# Altium schematic sheet mcu.SchDoc
size A4
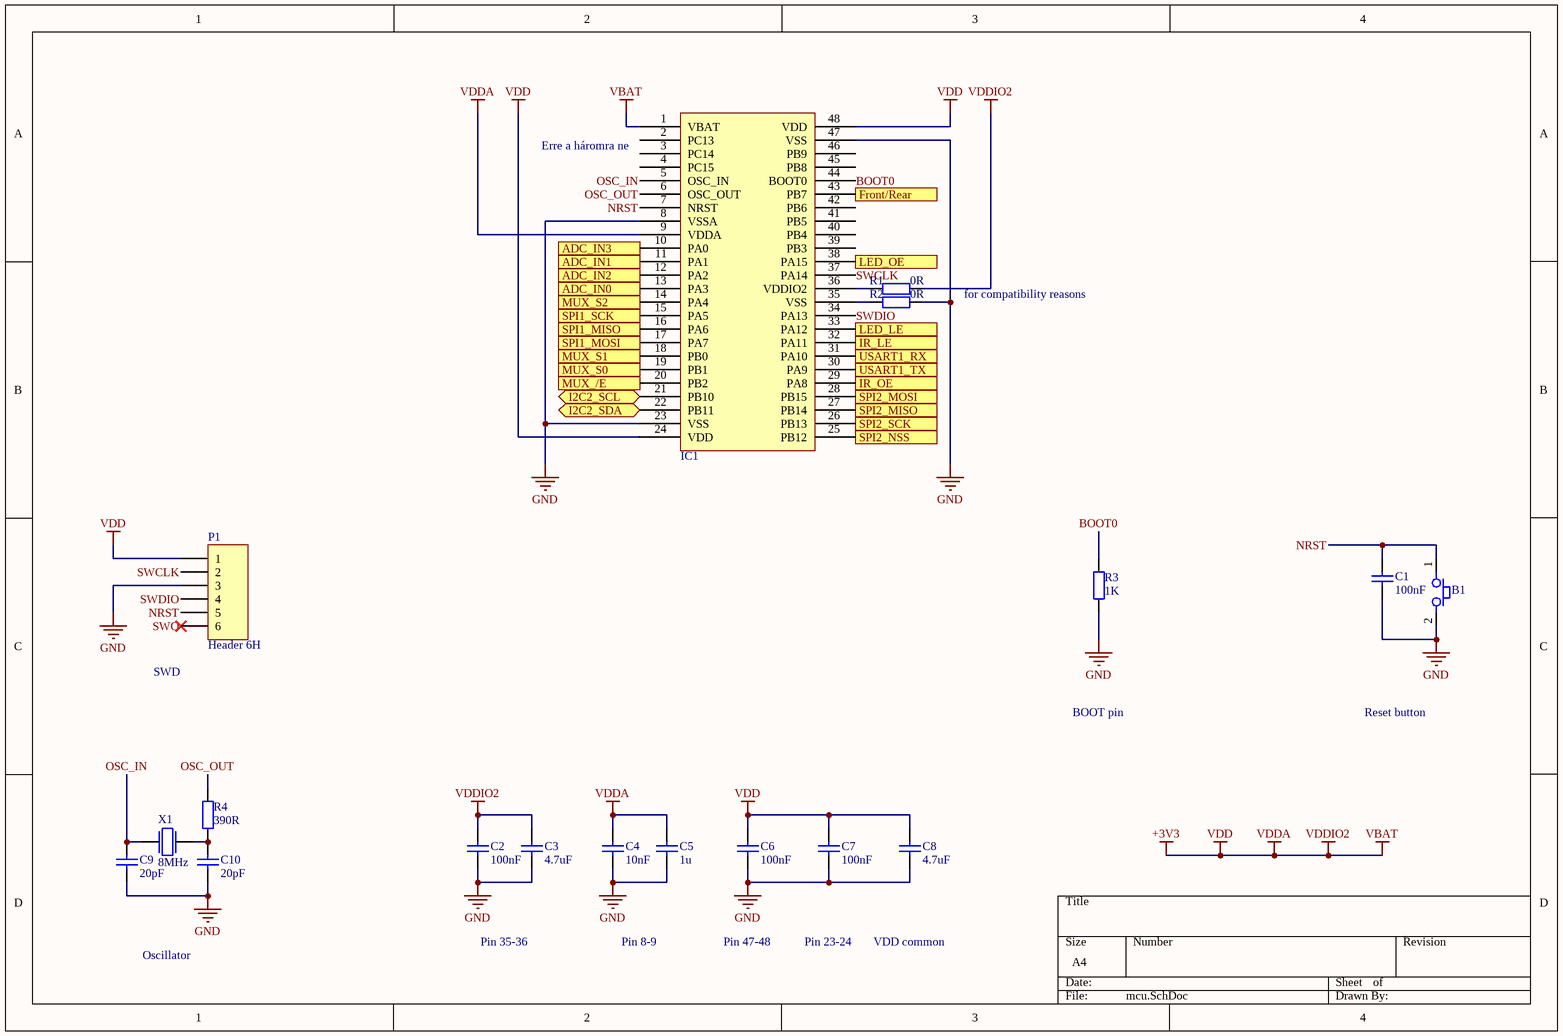
[diagram p0: mcu.SchDoc]

## Parts
B1  Button small  [FP_BTN_SMD_3x6]  (value not drawn)
C1  100nF  [FP_0805_CAP_085]
C2  100nF  [FP_0805_CAP_085]
C3  4.7uF  [FP_0805_CAP_085]
C4  10nF  [FP_0805_CAP_085]
C5  1u  [FP_0805_CAP_085]
C6  100nF  [FP_0805_CAP_085]
C7  100nF  [FP_0805_CAP_085]
C8  4.7uF  [FP_0805_CAP_085]
C9  20pF  [FP_0805_CAP_085]
C10  20pF  [FP_0805_CAP_085]
IC1  STM32F030C8T6  [LQFP48]  (value not drawn)
P1  Header 6H  [HDR1X6H]
R1  0R  [FP_0805_RES]
R2  0R  [FP_0805_RES]
R3  1K  [FP_0805_RES]
R4  390R  [FP_0805_RES]
X1  8MHz  [FP_CRYSTAL_HC49]

## Ports
ADC_IN0 (in), ADC_IN1 (in), ADC_IN2 (in), ADC_IN3 (in), Front/Rear (in), I2C2_SCL (bidir), I2C2_SDA (bidir), IR_LE (out), IR_OE (out), LED_LE (out), LED_OE (out), MUX_/E (out), MUX_S0 (out), MUX_S1 (out), MUX_S2 (out), SPI1_MISO (in), SPI1_MOSI (out), SPI1_SCK (out), SPI2_MISO (out), SPI2_MOSI (in), SPI2_NSS (in), SPI2_SCK (in), USART1_RX (in), USART1_TX (out)

## Nets
+3V3: C2.2 C3.2 C4.2 C5.2 C6.2 C7.2 C8.2 IC1.1(VBAT) IC1.9(VDDA) IC1.24(VDD) IC1.48(VDD) P1.1 R1.2  [also labelled VBAT, VDD, VDDA, VDDIO2]
GND: B1.2 C1.1 C2.1 C3.1 C4.1 C5.1 C6.1 C7.1 C8.1 C9.2 C10.2 IC1.8(VSSA) IC1.23(VSS) IC1.47(VSS) P1.3 R2.2 R3.1
ADC_IN0: IC1.13(PA3) ; port ADC_IN0
ADC_IN1: IC1.11(PA1) ; port ADC_IN1
ADC_IN2: IC1.12(PA2) ; port ADC_IN2
ADC_IN3: IC1.10(PA0) ; port ADC_IN3
BOOT0: IC1.44(BOOT0) R3.2
Front/Rear: IC1.43(PB7) ; port Front/Rear
I2C2_SCL: IC1.21(PB10) ; port I2C2_SCL
I2C2_SDA: IC1.22(PB11) ; port I2C2_SDA
IR_LE: IC1.32(PA11) ; port IR_LE
IR_OE: IC1.29(PA8) ; port IR_OE
LED_LE: IC1.33(PA12) ; port LED_LE
LED_OE: IC1.38(PA15) ; port LED_OE
MUX_/E: IC1.20(PB2) ; port MUX_/E
MUX_S0: IC1.19(PB1) ; port MUX_S0
MUX_S1: IC1.18(PB0) ; port MUX_S1
MUX_S2: IC1.14(PA4) ; port MUX_S2
NRST: B1.1 C1.2 IC1.7(NRST) P1.5
OSC_IN: C9.1 IC1.5(OSC_IN) X1.1
OSC_OUT: IC1.6(OSC_OUT) R4.2
SPI1_MISO: IC1.16(PA6) ; port SPI1_MISO
SPI1_MOSI: IC1.17(PA7) ; port SPI1_MOSI
SPI1_SCK: IC1.15(PA5) ; port SPI1_SCK
SPI2_MISO: IC1.27(PB14) ; port SPI2_MISO
SPI2_MOSI: IC1.28(PB15) ; port SPI2_MOSI
SPI2_NSS: IC1.25(PB12) ; port SPI2_NSS
SPI2_SCK: IC1.26(PB13) ; port SPI2_SCK
SWCLK: IC1.37(PA14) P1.2
SWDIO: IC1.34(PA13) P1.4
SWO: P1.6
USART1_RX: IC1.31(PA10) ; port USART1_RX
USART1_TX: IC1.30(PA9) ; port USART1_TX
NetC10_1: C10.1 R4.1 X1.2
NetIC1_35: IC1.35(VSS) R2.1
NetIC1_36: IC1.36(VDDIO2) R1.1

Not connected (* = marked no-connect by the designer): IC1 2(PC13) 3(PC14) 4(PC15) 39(PB3) 40(PB4) 41(PB5) 42(PB6) 45(PB8) 46(PB9)

## Notes on the sheet
- (near IC1) Erre a háromra ne
- for compatibility reasons
- (near P1) SWD
- BOOT pin
- Reset button
- Oscillator
- Pin 35-36
- Pin 8-9
- Pin 47-48
- Pin 23-24
- VDD common

## Library data of the parts
B1 = Button small: Push button; Name: TACT 3x 6 2P SPST 1 TS-363 (FEM) SMD 3.5x6mm H=4.3mm; Reference: 45-08-58; Supplier: Lomex
C1 C2 C6 C7 = CAP 100nF: Capacitor; Voltage: 50V; Reference: 2407344; Supplier: Farnell; Value: 100nF
C3 C8 = CAP 47uF: Capacitor; Reference: 2409055; Supplier: Farnell; Value: 4.7uF
C4 = CAP 10nF: Capacitor; Reference: 2896552; Supplier: Farnell; Value: 10nF
C5 = CAP: Capacitor; Reference: 2896565; Supplier: Farnell; Value: 1u
C9 C10 = CAP 100nF: Capacitor; Reference: 2581087; Value: 20pF; Supplier: Farnell
IC1 = STM32F030C8T6: STM32F030C8T6 ARM MCU; Reference: 2393634; Supplier: Farnell
P1 = Header 6H: Header, 6-Pin, Right Angle; Reference: ???; LatestRevisionDate: 17-Jul-2002; LatestRevisionNote: Re-released for DXP Platform.; Publisher: Altium Limited; Supplier: Árwill
R1 R2 = RES: Resistor; Reference: R_0; Value: 0R
R3 = RES 1K: Resistor; Reference: R_1K; Value: 1K
R4 = RES 390R: Resistor; Reference: 2072995; Supplier: Farnell; Value: 390R
X1 = Crystal: Quarz Crystal; Name: 8.000000MHz QUARZ HC49/S (NSK) 30ppm 20pF LOW PROFILE; Value: 8MHz; Reference: 40-01-16; Supplier: Lomex